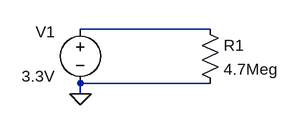
[diagram p0: schematic simple0.asc]
simple0.asc, the LTspice schematic file:
Version 4
SHEET 1 880 680
WIRE 336 256 144 256
WIRE 336 336 144 336
WIRE 144 352 144 336
FLAG 144 352 0
SYMBOL voltage 144 240 R0
WINDOW 0 -66 20 Left 2
WINDOW 3 -87 86 Left 2
SYMATTR InstName V1
SYMATTR Value 3.3V
SYMBOL res 320 240 R0
SYMATTR InstName R1
SYMATTR Value 4.7Meg

The netlist it stands for:
* simple0.asc
V1 N001 0 3.3V
R1 N001 0 4.7Meg
.backanno
.end